# EAGLE design sensorboard-v2.0 (EAGLE 5.05)
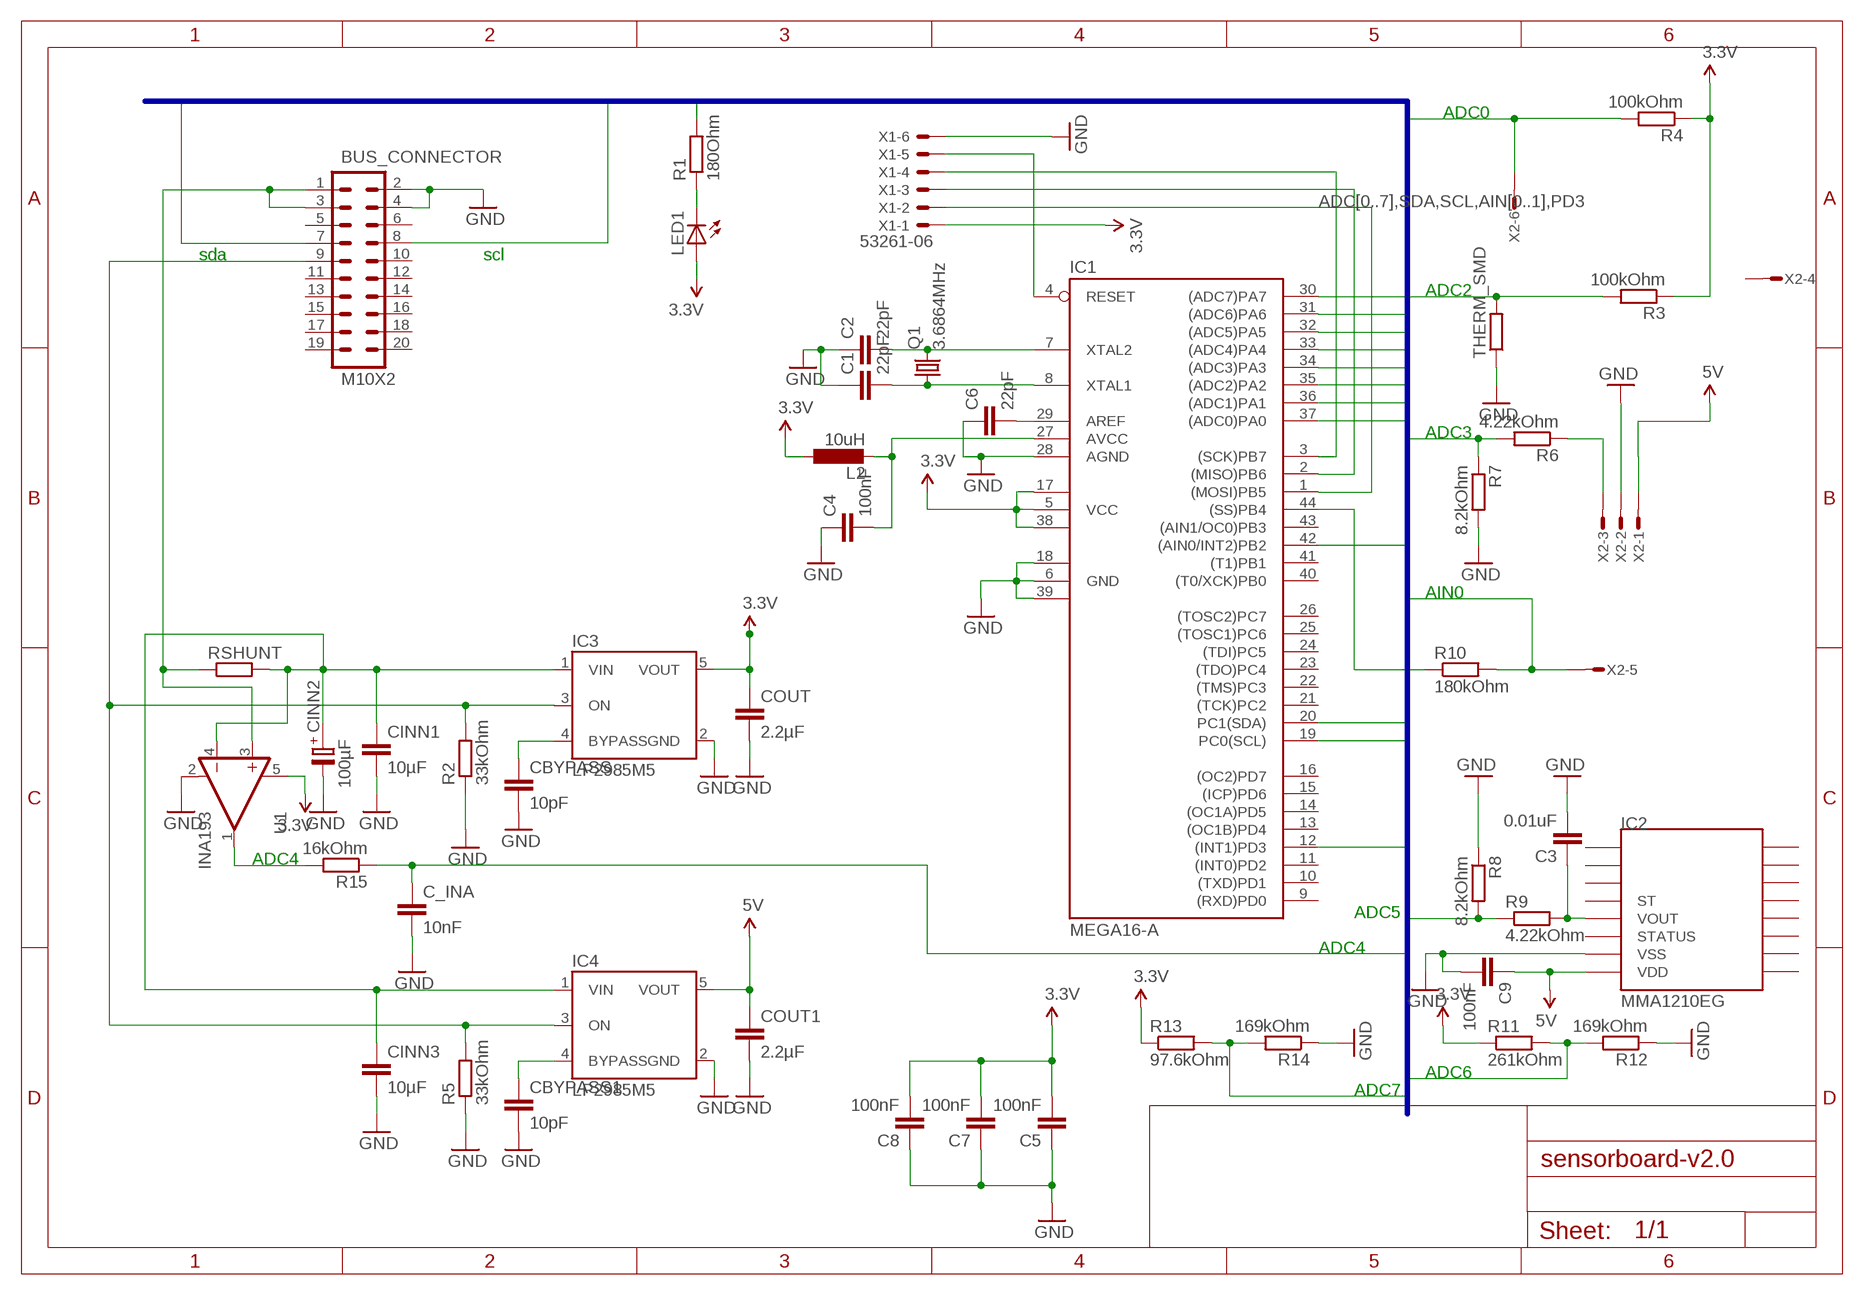
[diagram p0: schematic, sheet 1]

## Parts
BUS_CONNECTOR  M10X2  [2X10]
C1  22pF  C-EUC0805  [C0805]
C2  22pF  C-EUC0805  [C0805]
C3  0.01uF  C-EUC0805  [C0805]
C4  100nF  C-EUC0805  [C0805]
C5  100nF  C-EUC0805  [C0805]
C6  22pF  C-EUC0805  [C0805]
C7  100nF  C-EUC0805  [C0805]
C8  100nF  C-EUC0805  [C0805]
C9  100nF  C-EUC0805  [C0805]
C_INA  10nF  C-EUC0805  [C0805]
CBYPASS  10pF  C-EUC0805  [C0805]
CBYPASS1  10pF  C-EUC0805  [C0805]
CINN1  10µF  C-EUC0805  [C0805]
CINN2  100µF  C-PR-SMD-SV-C  [SV-C]
CINN3  10µF  C-EUC0805  [C0805]
COUT  2.2µF  C-EUC0805  [C0805]
COUT1  2.2µF  C-EUC0805  [C0805]
IC1  MEGA16-A  [TQFP44]
IC2  MMA1210EG  [SOIC-16]
IC3  LP2985M5  [SOT23-5]
IC4  LP2985M5  [SOT23-5]
L2  10uH  INDUCTOR  [C0805]
LED1  LEDCHIPLED_0805  [CHIPLED_0805]
Q1  3.6864MHz  CRYSTALHC49UP  [HC49UP]
R1  180Ohm  R-EU_R0805  [R0805]
R2  33kOhm  R-EU_R0805  [R0805]
R3  100kOhm  R-EU_R0805  [R0805]
R4  100kOhm  R-EU_R0805  [R0805]
R5  33kOhm  R-EU_R0805  [R0805]
R6  4.22kOhm  R-EU_R0805  [R0805]
R7  8.2kOhm  R-EU_R0805  [R0805]
R8  8.2kOhm  R-EU_R0805  [R0805]
R9  4.22kOhm  R-EU_R0805  [R0805]
R10  180kOhm  R-EU_R0805  [R0805]
R11  261kOhm  R-EU_R0805  [R0805]
R12  169kOhm  R-EU_R0805  [R0805]
R13  97.6kOhm  R-EU_R0805  [R0805]
R14  169kOhm  R-EU_R0805  [R0805]
R15  16kOhm  R-EU_R0805  [R0805]
RSHUNT  R-EU_R0805  [R0805]
THERM_SMD  R-EU_R0805  [R0805]
U1  INA193  [SOT23-5]
X1  53261-06  [53261-06]
X2  MICROMATCH-6SM  [MMT-SMD-6]

## Nets
3.3V: C5.2 C7.2 C8.2 COUT.1 IC1.5(VCC) IC1.17(VCC1) IC1.38(VCC2) IC3.5(VOUT) L2.1 LED1.A R3.1 R4.1 R11.1 R13.1 U1.5(V+) X1.1
5V: C9.1 COUT1.1 IC2.VDD IC4.5(VOUT) X2.1
ADC0: IC1.37((ADC0)PA0) R4.2 X2.6
ADC1: IC1.36((ADC1)PA1)
ADC2: IC1.35((ADC2)PA2) R3.2 THERM_SMD.2
ADC3: IC1.34((ADC3)PA3) R6.2 R7.1
ADC4: C_INA.1 IC1.33((ADC4)PA4) R15.1
ADC5: IC1.32((ADC5)PA5) R8.2 R9.1
ADC6: IC1.31((ADC6)PA6) R11.2 R12.2
ADC7: IC1.30((ADC7)PA7) R13.2 R14.2
AIN0: IC1.42((AIN0/INT2)PB2) R10.2 X2.5
GND: BUS_CONNECTOR.2 BUS_CONNECTOR.4 C1.1 C2.1 C3.2 C4.1 C5.1 C6.1 C7.1 C8.1 C9.2 C_INA.2 CBYPASS1.2 CBYPASS.2 CINN1.2 CINN2.- CINN3.2 COUT1.2 COUT.2 IC1.6(GND) IC1.18(GND1) IC1.28(AGND) IC1.39(GND2) IC2.VSS IC3.2(GND) IC4.2(GND) R2.1 R5.1 R7.2 R8.1 R12.1 R14.1 THERM_SMD.1 U1.2(GND) X1.6 X2.2
MISO: IC1.2((MISO)PB6) X1.3
MOSI: IC1.1((MOSI)PB5) X1.2
N$1: LED1.C R1.1
N$2: IC1.44((SS)PB4) R10.1
N$3: C6.2 IC1.29(AREF)
N$4: C1.2 IC1.8(XTAL1) Q1.1
N$5: C2.2 IC1.7(XTAL2) Q1.2
N$6: R6.1 X2.3
N$7: CBYPASS.1 IC3.4(BYPASS)
N$8: CINN1.1 CINN2.+ CINN3.1 IC3.1(VIN) IC4.1(VIN) RSHUNT.2 U1.4(VIN-)
N$9: C4.2 IC1.27(AVCC) L2.2
N$10: BUS_CONNECTOR.9 IC3.3(ON) IC4.3(ON) R2.2 R5.2
N$11: BUS_CONNECTOR.1 BUS_CONNECTOR.3 RSHUNT.1 U1.3(VIN+)
N$12: CBYPASS1.1 IC4.4(BYPASS)
N$13: C3.1 IC2.VOUT R9.2
N$14: R15.2 U1.1(OUT)
PD3: IC1.12((INT1)PD3) R1.2
RST: IC1.4(RESET) X1.5
SCK: IC1.3((SCK)PB7) X1.4
SCL: BUS_CONNECTOR.8 IC1.19(PC0(SCL))
SDA: BUS_CONNECTOR.7 IC1.20(PC1(SDA))
Unconnected: BUS_CONNECTOR.5 BUS_CONNECTOR.6 BUS_CONNECTOR.10 BUS_CONNECTOR.11 BUS_CONNECTOR.12 BUS_CONNECTOR.13 BUS_CONNECTOR.14 BUS_CONNECTOR.15 BUS_CONNECTOR.16 BUS_CONNECTOR.17 BUS_CONNECTOR.18 BUS_CONNECTOR.19 BUS_CONNECTOR.20 IC1.9((RXD)PD0) IC1.10((TXD)PD1) IC1.11((INT0)PD2) IC1.13((OC1B)PD4) IC1.14((OC1A)PD5) IC1.15((ICP)PD6) IC1.16((OC2)PD7) IC1.21((TCK)PC2) IC1.22((TMS)PC3) IC1.23((TDO)PC4) IC1.24((TDI)PC5) IC1.25((TOSC1)PC6) IC1.26((TOSC2)PC7) IC1.40((T0/XCK)PB0) IC1.41((T1)PB1) IC1.43((AIN1/OC0)PB3) IC2.P$1 IC2.P$2 IC2.P$3 IC2.P$4 IC2.P$5 IC2.P$6 IC2.P$7 IC2.P$8 IC2.P$9 IC2.P$10 IC2.P$11 IC2.ST IC2.STATUS X2.4

## Buses
ADC[0..7],SDA,SCL,AIN[0..1],PD3

## Notes on the sheet
- ADC0
- sda | scl
- ADC2
- ADC3
- AIN0
- ADC4
- ADC5
- ADC4
- ADC6
- ADC7

## Library data of the parts
BUS_CONNECTOR = SparkFunedit:M10X2: This was SPECIALLY designed to be used with our Graphic LCD Backpack. Be sure you want to use this! It is not only staggered on each line of header holes, but IT IS ALSO offset of the center point of the top and bottom lines by 5 mil. This causes the headers to lock into place on the "standard" footprint on the LCD screen. The extra squares on the tdocu layer are there simply to reference other pins (if you were to actually populate a longer header than ten long - this is what we do with the backpacks).
C1-C9 = resistor:C-EU: CAPACITOR, European symbol
C_INA CBYPASS CBYPASS1 CINN1 CINN3 COUT COUT1 = rcl:C-EU: CAPACITOR, European symbol
CINN2 = cap-pan40:C-PR: POLARIZED ELECTROLYTIC/TANTALUM
IC1 = avr-5:MEGA16: MICROCONTROLLER 16 Kbytes FLASH 1 kbytes SRAM 512 bytes EEPROM USART 8-channel 10 bit ADC
IC2 = cansat:MMA1210EG
IC3 IC4 = v-reg-3:LP2985: National Semiconductor <http://www.national.com> Micropower Linear Regulator 150mA regulated output, Vin 16V max., ultra-low dropout of 300mV @ 150mA, 1µA standby current, low noise
L2 = cansat:INDUCTOR
LED1 = led:LED: LED OSRAM: - CHIPLED LG R971, LG N971, LY N971, LG Q971, LY Q971, LO R971, LY R971 LH N974, LH R974 LS Q976, LO Q976, LY Q976 LO Q996 - Hyper CHIPLED LW Q18S LB Q993, LB Q99A, LB R99A - SideLED LS A670, LO A670, LY A670, LG A670, LP A670 LB A673, LV A673, LT A673, LW A673 LH A674 LY A675 LS A676, LA A676, LO A676, LY A676, LW A676 LS A679, LY A679, LG A679 - Hyper Micro SIDELED® LS Y876, LA Y876, LO Y876, LY Y876 LT Y87S - SmartLED LW L88C, LW L88S LB L89C, LB L89S, LG L890 LS L89K, LO L89K, LY L89K LS L896, LA L896, LO L896, LY L896 - TOPLED LS T670, LO T670, LY T670, LG T670, LP T670 LSG T670, LSP T670, LSY T670, LOP T670, LYG T670 LG T671, LOG T671, LSG T671 LB T673, LV T673, LT T673, LW T673 LH T674 LS T676, LA T676, LO T676, LY T676, LB T676, LH T676, LSB T676, LW T676 LB T67C, LV T67C, LT T67C, LS T67K, LO T67K, LY T67K, LW E67C LS E67B, LA E67B, LO E67B, LY E67B, LB E67C, LV E67C, LT E67C LW T67C LS T679, LY T679, LG T679 LS T770, LO T770, LY T770, LG T770, LP T770 LB T773, LV T773, LT T773, LW T773 LH T774 LS E675, LA E675, LY E675, LS T675 LS T776, LA T776, LO T776, LY T776, LB T776 LHGB T686 LT T68C, LB T68C - Hyper Mini TOPLED® LB M676 - Mini TOPLED Santana® LG M470 LS M47K, LO M47K, LY M47K Source: http://www.osram.convergy.de LUXEON: - LUMILED® LXK2-PW12-R00, LXK2-PW12-S00, LXK2-PW14-U00, LXK2-PW14-V00 LXK2-PM12-R00, LXK2-PM12-S00, LXK2-PM14-U00 LXK2-PE12-Q00, LXK2-PE12-R00, LXK2-PE12-S00, LXK2-PE14-T00, LXK2-PE14-U00 LXK2-PB12-K00, LXK2-PB12-L00, LXK2-PB12-M00, LXK2-PB14-N00, LXK2-PB14-P00, LXK2-PB14-Q00 LXK2-PR12-L00, LXK2-PR12-M00, LXK2-PR14-Q00, LXK2-PR14-R00 LXK2-PD12-Q00, LXK2-PD12-R00, LXK2-PD12-S00 LXK2-PH12-R00, LXK2-PH12-S00 LXK2-PL12-P00, LXK2-PL12-Q00, LXK2-PL12-R00 Source: www.luxeon.com KINGBRIGHT: KA-3528ASYC Source: www.kingbright.com
Q1 = crystal:CRYSTAL: CRYSTAL
R1 R3 R4 R6-R14 THERM_SMD = resistor:R-EU_: RESISTOR, European symbol
R2 R5 R15 RSHUNT = rcl:R-EU_: RESISTOR, European symbol
U1 = burr-brown:INA193
X1 = con-molex:53?-06: CONNECTOR wire to board 1.25 mm (.049 inch) pitch header
X2 = con-amp-micromatch:MICROMATCH-6: MicroMaTch 6 7-215464-6 / 0-215464-6 Drawing Number C-215464 DDEController.pdf

## Board
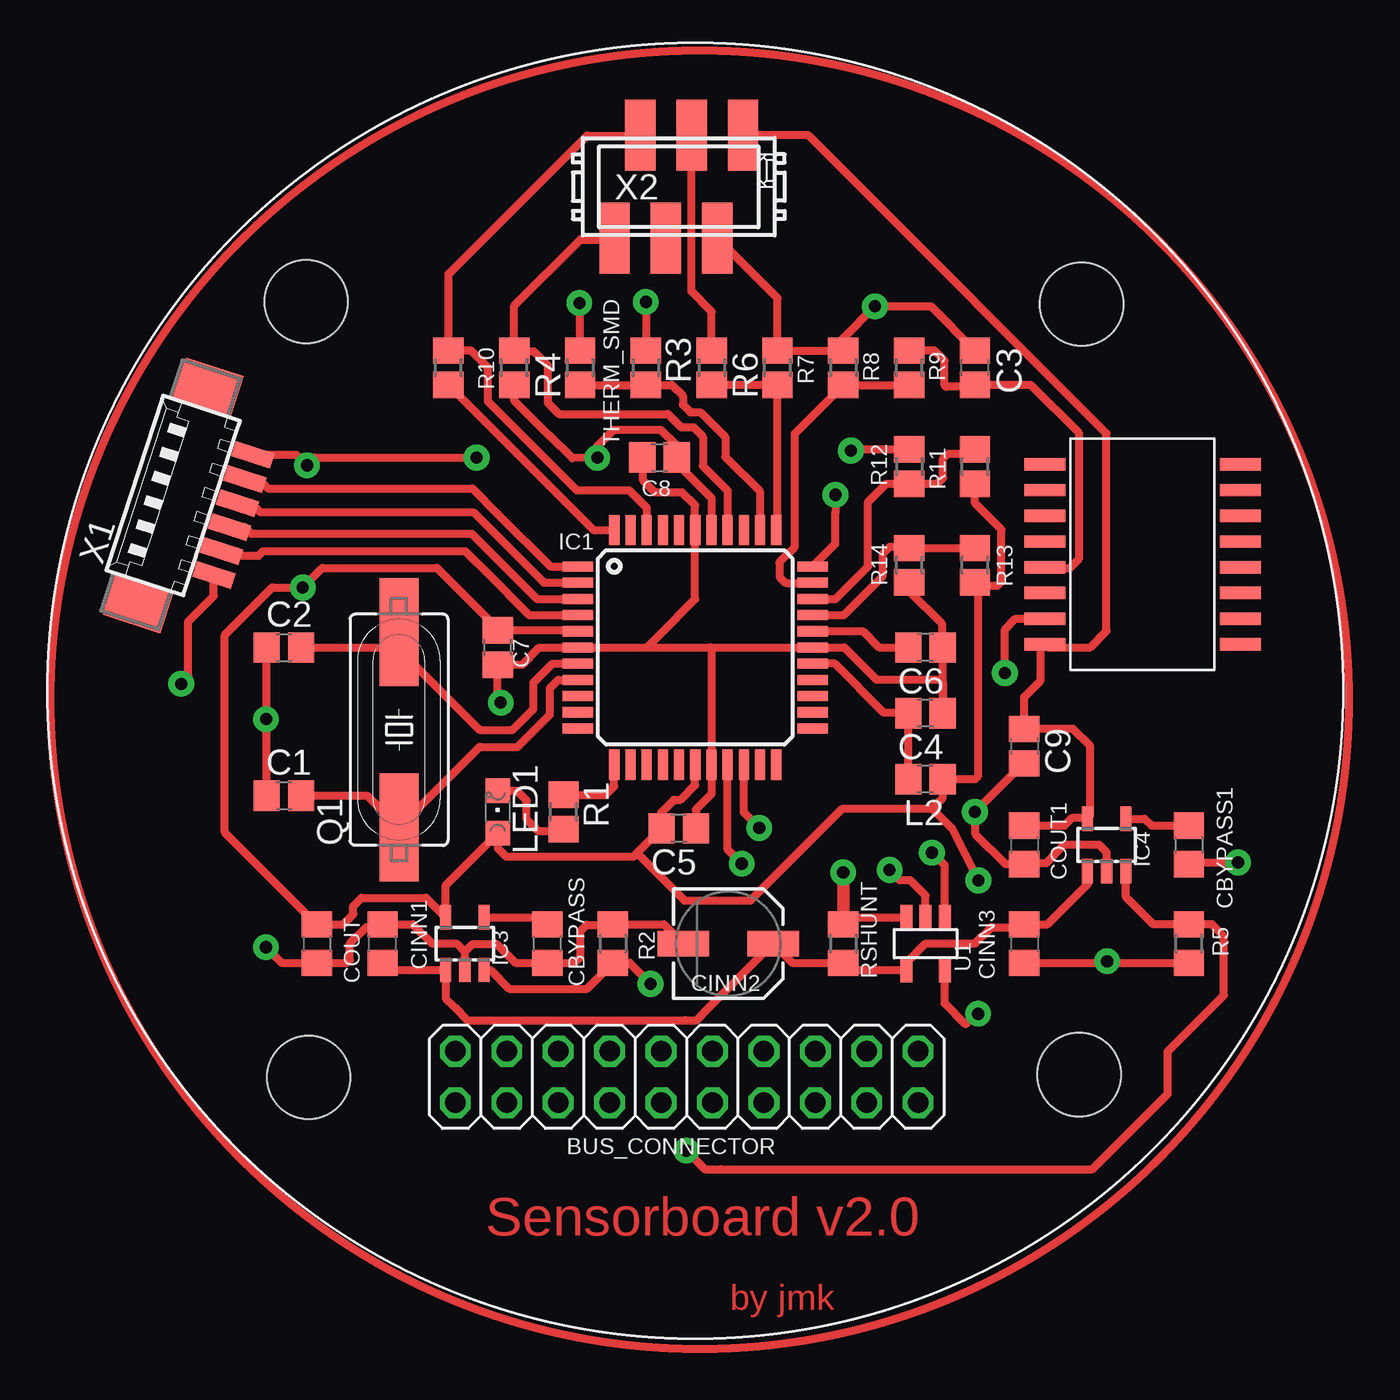
[diagram p1: board, top side]
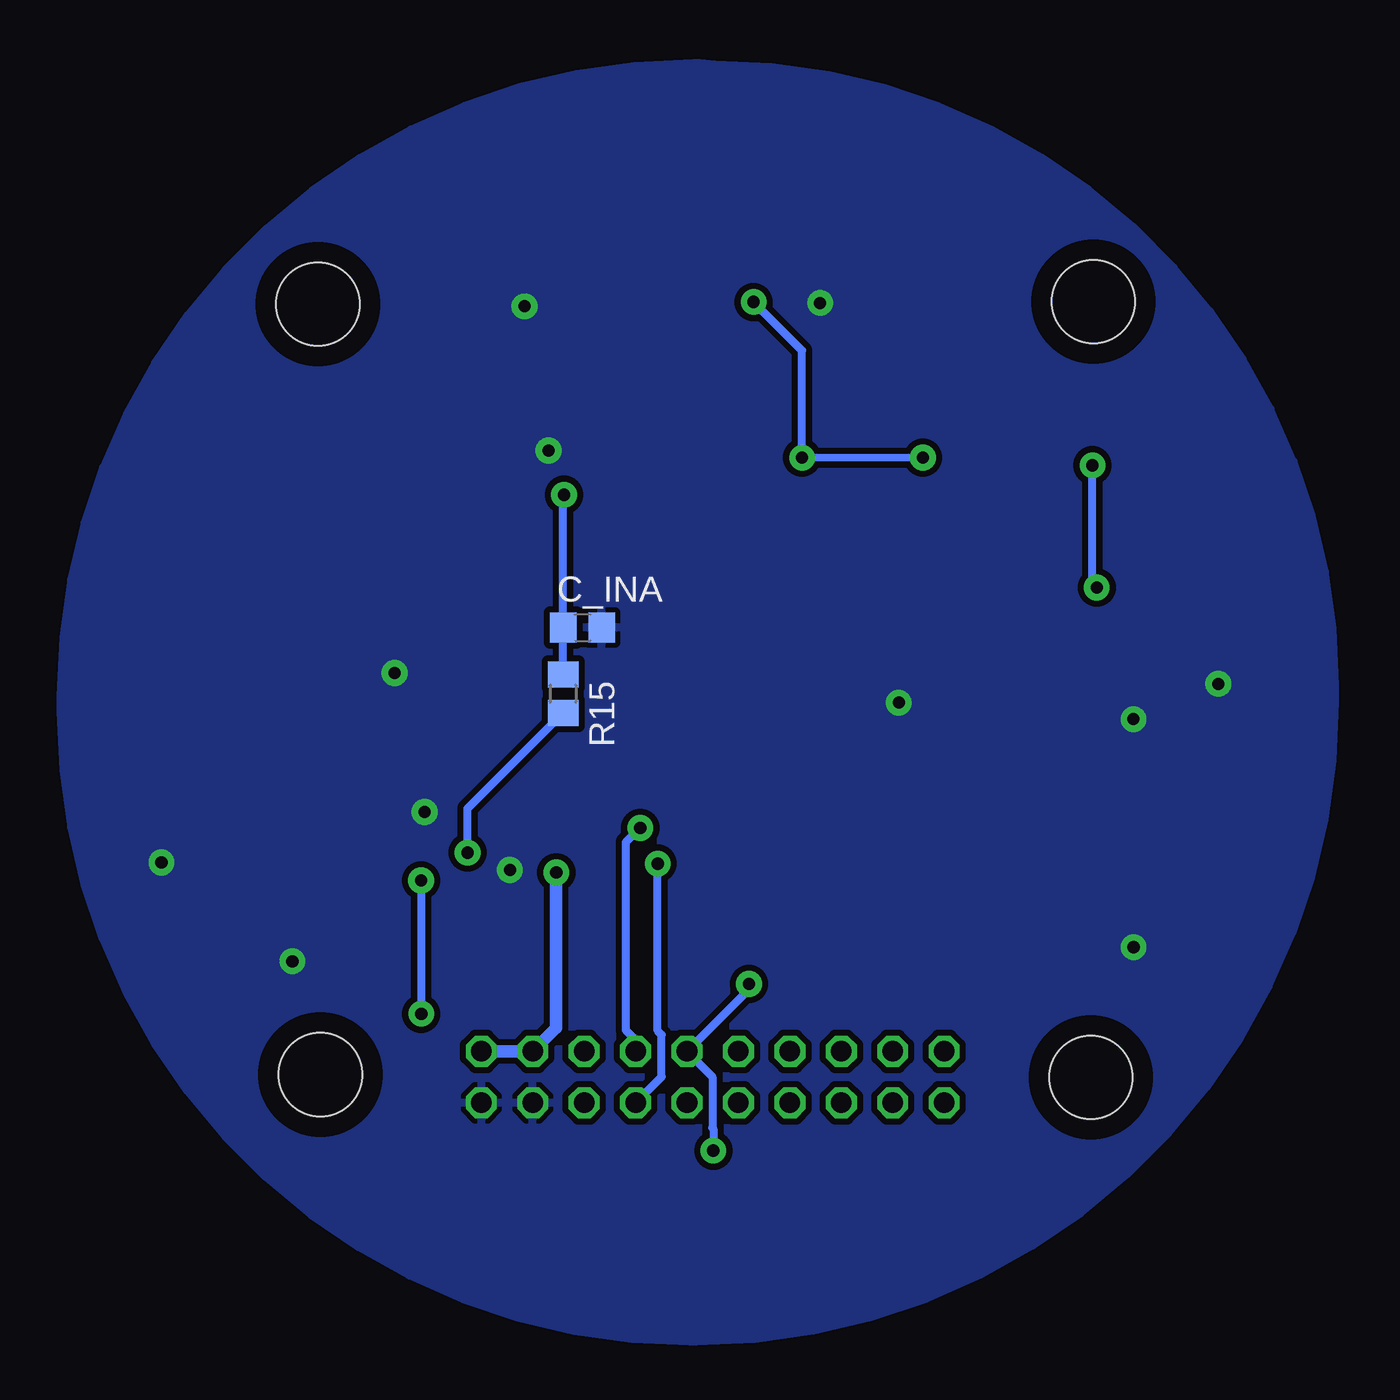
[diagram p2: board, bottom side, seen from below]

No outline drawn. Coordinates in mm, seen from the top.
Copper layers (1*16): Top 0.035mm / dielectric 1.5mm / Bottom 0.035mm
Design rules "default *": minimum track width 10mil, minimum drill 0.0152mm, track to track 12mil, track to pad 12mil, pad to pad 12mil, via to via 12mil, smd to smd 11mil, copper to edge 40mil, drill to drill 8mil, minimum pad ring 10mil, minimum via ring 8mil, stop-mask expansion 4mil, vias tented up to drill 0mil, thermal gap 10mil

### Footprints (pad centres in the part's own frame; a part is rotated, then mirrored left to right if it is on the bottom)
2X10 = drill 1.016 octagon: 1 -11.013,-7.687; 2 -11.013,-5.147; 3 -8.473,-7.687; 4 -8.473,-5.147; 5 -5.933,-7.687; 6 -5.933,-5.147; 7 -3.393,-7.687; 8 -3.393,-5.147; 9 -0.853,-7.687; 10 -0.853,-5.147; 11 1.687,-7.687; 12 1.687,-5.147; 13 4.227,-7.687; 14 4.227,-5.147; 15 6.767,-7.687; 16 6.767,-5.147; 17 9.307,-7.687; 18 9.307,-5.147; 19 11.847,-7.687; 20 11.847,-5.147 | hole 4.1: 19.093,-6.407; 19.22,-44.715; -19.087,-44.591; -18.964,-6.533
C0805 = smd 1.3 x 1.5: 1 -0.85,0; 2 0.85,0
C0805' = smd 1.3 x 1.5: 1 -0.95,0; 2 0.95,0
SV-C = smd 2.54 x 1.27: + -2.223,0; - 2.223,0
TQFP44 = smd 1.5 x 0.5: 1 -5.8,4; 2 -5.8,3.2; 3 -5.8,2.4; 4 -5.8,1.6; 5 -5.8,0.8; 6 -5.8,0; 7 -5.8,-0.8; 8 -5.8,-1.6; 9 -5.8,-2.4; 10 -5.8,-3.2; 11 -5.8,-4; 23 5.8,-4; 24 5.8,-3.2; 25 5.8,-2.4; 26 5.8,-1.6; 27 5.8,-0.8; 28 5.8,0; 29 5.8,0.8; 30 5.8,1.6; 31 5.8,2.4; 32 5.8,3.2; 33 5.8,4 | smd 0.5 x 1.5: 12 -4,-5.8; 13 -3.2,-5.8; 14 -2.4,-5.8; 15 -1.6,-5.8; 16 -0.8,-5.8; 17 0,-5.8; 18 0.8,-5.8; 19 1.6,-5.8; 20 2.4,-5.8; 21 3.2,-5.8; 22 4,-5.8; 34 4,5.8; 35 3.2,5.8; 36 2.4,5.8; 37 1.6,5.8; 38 0.8,5.8; 39 0,5.8; 40 -0.8,5.8; 41 -1.6,5.8; 42 -2.4,5.8; 43 -3.2,5.8; 44 -4,5.8
SOIC-16 = smd 0.61 x 2.03: P$1 -2.54,2.54; P$2 -1.27,2.54; P$3 0,2.54; P$4 1.27,2.54; P$5 2.54,2.54; P$6 3.81,2.54; P$7 5.08,2.54; P$8 6.35,2.54; P$9 -2.54,-7.11; P$10 -1.27,-7.11; P$11 0,-7.11; ST 1.27,-7.11; STATUS 3.81,-7.11; VDD 6.35,-7.11; VOUT 2.54,-7.11; VSS 5.08,-7.11
SOT23-5 = smd 0.55 x 1.2: 1 -0.95,-1.3; 2 0,-1.3; 3 0.95,-1.3; 4 0.95,1.3; 5 -0.95,1.3
CHIPLED_0805 = smd 1.2 x 1.2: A 0,-1.05; C 0,1.05
HC49UP = smd 5.334 x 1.93: 1 -4.826,0; 2 4.826,0
R0805 = smd 1.3 x 1.5: 1 -0.85,0; 2 0.85,0
R0805' = smd 1.3 x 1.5: 1 -0.95,0; 2 0.95,0
SOT23-5' = smd 0.6 x 1.2: 1 -0.95,-1.306; 2 0,-1.306; 3 0.95,-1.306; 4 0.95,1.306; 5 -0.95,1.306
53261-06 = smd 0.8 x 2: 1 3.125,-2.5; 2 1.875,-2.5; 3 0.625,-2.5; 4 -0.625,-2.5; 5 -1.875,-2.5; 6 -3.125,-2.5 | smd 2.1 x 3: S1 5.625,0.625; S2 -5.625,0.625
MMT-SMD-6 = smd 1.5 x 3.5: 1 3.175,2.54; 2 1.905,-2.54; 3 0.635,2.54; 4 -0.635,-2.54; 5 -1.905,2.54; 6 -3.175,-2.54

### Placement (x,y rotation side)
BUS_CONNECTOR  47.96,13 180 top
C1  27.64,33.32 0 top
C2  27.64,40.64 0 top
C3  61.77,54.46 90 top
C4  59.33,37.39 180 top
C5  47.14,31.7 180 top
C6  59.33,40.64 180 top
C7  38.2,40.64 90 top
C8  46.19,50.02 0 top
C9  64.21,35.76 270 top
C_INA  10nF  [C0805']  53.97,41.62 0 bottom
CBYPASS  10pF  [C0805']  40.64,26.01 270 top
CBYPASS1  10pF  [C0805']  72.34,30.89 270 top
CINN1  10µF  [C0805']  32.51,26.01 90 top
CINN2  49.58,26.01 180 top
CINN3  10µF  [C0805']  64.21,26.01 270 top
COUT  2.2µF  [C0805']  29.26,26.01 270 top
COUT1  2.2µF  [C0805']  64.21,30.89 270 top
IC1  47.96,40.64 0 top
IC2  72.34,47.14 270 top
IC3  36.58,26.01 0 top
IC4  68.28,30.89 0 top
L2  59.33,34.14 180 top
LED1  38.2,32.51 0 top
Q1  33.32,36.58 90 top
R1  41.45,32.51 90 top
R2  33kOhm  [R0805']  43.89,26.01 270 top
R3  45.52,54.46 270 top
R4  39.01,54.46 90 top
R5  33kOhm  [R0805']  72.34,26.01 90 top
R6  48.77,54.46 270 top
R7  52.02,54.46 90 top
R8  55.27,54.46 270 top
R9  58.52,54.46 90 top
R10  35.76,54.46 90 top
R11  61.77,49.58 90 top
R12  58.52,49.58 270 top
R13  61.77,44.7 90 top
R14  58.52,44.7 90 top
R15  16kOhm  [R0805']  54.93,38.35 270 bottom
RSHUNT  [R0805']  55.27,26.01 270 top
THERM_SMD  42.27,54.46 270 top
U1  INA193  [SOT23-5']  59.33,26.01 180 top
X1  22.76,47.96 72 top
X2  47.14,63.4 0 top

### Tracks (layer width: path | path; a pad name or v marks a point on that pad's centre or on a via)
3.3V  (via drill 0.6 pad 1.27)
  Top 0.406: 42.1,41.49 IC1.5 42.1,41.49 | X1.1 28.26,50.16 v28.78,49.64 29.16,50.02 v37.15,50.02 | C7.2 38.03,41.49 | C7.2 42.1,41.49 | R11.1 61.77,47.77 63.08,46.46 63.08,43.9 62.87,43.69 61.94,43.69 | 61.94,43.69 R13.1 | IC1.17 47.95,33.85 47.22,33.11 46.9,33.11 46.28,32.49 46.29,32.48 C5.2 45.08,30.48 | R4.1 39.01,52.84 40.76,51.09 40.79,51.09 41.89,49.99 v43.12,50.01 43.12,50.59 43.93,51.4 46.25,51.4 47.02,50.63 47.02,50.05 C8.2 47.04,49.74 48.23,48.55 48.76,48.02 IC1.38 | 45.08,30.48 44.91,30.32 38.62,30.32 38.2,30.73 LED1.A 35.63,28.89 IC3.5 34.66,28.27 31.47,28.27 31.06,27.85 31.06,27.46 30.55,26.96 COUT.1 24.71,31.51 24.71,41.24 27.07,43.6 v28.57,43.6 29.47,44.51 29.54,44.57 35.2,44.57 38.2,41.58 C7.2 | 45.08,30.48 47.42,28.14 50.7,28.14 50.7,28.16 53.84,31.3 55.23,32.69 59.66,32.69 | U1.5 60.28,23.05 61.31,22.03 61.83,22.55 v61.93,22.55 | v45.52,57.71 R3.1 | 61.94,43.69 61.94,34.3 61.77,34.14 L2.1 60.18,33.22 59.66,32.69 | v61.95,29.13 60.64,31.7 59.66,32.69
  Bottom 0.406: v28.78,49.64 28.78,43.81 v28.57,43.6 | v37.15,50.02 37.18,49.99 v43.12,50.01 43.12,55.32 v45.52,57.71 | v61.95,29.13 61.95,22.56 v61.93,22.55
5V
  Top 0.406: X2.1 53.54,65.94 55.27,64.21 68.28,51.21 68.28,41.45 67.46,40.64 65.38,40.64 IC2.VDD 65.02,40.59 65.02,39.01 64.21,38.2 C9.1 66.61,36.61 67.46,35.76 67.46,32.32 IC4.5 67.28,32.23 66.59,32.23 66.2,31.84 COUT1.1
ADC0
  Top 0.406: IC1.37 49.55,48.39 48.33,49.61 48.33,51.06 47.87,51.52 47.27,51.52 46.61,52.17 41.23,52.17 40.67,52.73 40.67,54.58 39.98,55.27 39.05,55.27 R4.2 39.01,57.52 42.28,60.79 43.9,60.79 X2.6
ADC2
  Top 0.406: THERM_SMD.2 R3.2 46.8,53.61 47.34,53.07 47.34,52.64 47.72,52.26 48.21,52.26 49.45,51.02 49.45,50.06 51.14,48.36 51.14,46.45 IC1.35
ADC3
  Top 0.406: IC1.34 52.02,46.5 R7.1 R6.2
ADC4  (via drill 0.6 pad 1.27)
  Top 0.406: IC1.33 54.86,45.75 54.86,47.27 54.88,47.29 v54.88,48.18
  Bottom 0.406: R15.1 C_INA.1 54.92,48.14 v54.88,48.18
ADC5
  Top 0.406: IC1.32 53.75,43.83 52.41,43.83 52.12,44.13 52.12,44.79 52.12,44.85 52.88,45.61 52.88,51.21 R8.2 R9.1
ADC6
  Top 0.406: IC1.31 53.77,43.02 54.87,43.02 56.49,44.64 56.49,47.83 57.39,48.73 R12.2 59.92,48.73 60.2,49.01 60.2,49.97 60.44,50.21 61.55,50.21 R11.2
ADC7
  Top 0.406: IC1.30 55.02,42.24 55.3,42.24 55.55,42.49 57.23,44.17 57.23,44.45 57.23,45.28 57.57,45.62 58.45,45.62 R14.2 R13.2
AIN0
  Top 0.406: IC1.42 45.55,47.54 44.7,48.4 42.1,48.4 37.71,52.79 37.71,54.47 36.89,55.3 35.77,55.3 R10.2 35.76,59.09 42.6,65.93 X2.5
GND  (via drill 0.6 pad 1.27)
  Top 0.406: 47.95,46.45 IC1.39 | X2.2 52.02,57.89 R7.2 R8.1 55.27,55.93 v56.83,57.49 59.59,57.49 C3.2 | THERM_SMD.1 42.27,57.62 v42.23,57.66 | v38.34,37.91 38.2,38.06 C7.1 39.41,39.79 40.25,40.63 42.14,40.63 IC1.6 45.56,40.64 45.62,40.69 | 47.95,46.45 47.95,43.02 46.16,41.23 45.62,40.69 | 48.71,40.64 45.66,40.64 45.62,40.69 | 48.71,40.64 IC1.28 55.33,40.64 56.91,39.05 60.09,39.05 60.18,38.96 C4.1 C6.1 60.16,40.67 60.16,41.79 58.52,43.43 R14.1 | 48.71,40.64 48.76,40.59 IC1.18 48.76,33.4 47.99,32.64 C5.1 | 47.95,46.45 47.95,47.66 47.31,48.3 45.97,48.3 45.38,48.89 45.38,49.99 C8.1 | R12.1 55.72,50.43 v55.65,50.36 | v26.75,25.84 27.52,25.06 COUT.2 30.75,25.06 30.89,25.2 30.89,26.01 31.7,26.82 32.38,26.82 CINN1.2 34,26.96 34.95,26.01 35.76,26.01 36.16,26.01 36.57,25.6 | 36.57,25.6 IC3.2 | 36.57,25.6 36.96,25.99 38.15,25.99 39.08,25.06 CBYPASS.2 42,25.06 42.28,25.34 42.28,26.64 42.58,26.94 43.87,26.94 R2.1 46.41,26.96 CINN2.- | C2.1 26.79,37.13 v26.75,37.1 26.79,37.07 C1.1 | IC2.VSS 63.78,42.06 63.26,41.54 v63.26,39.38 | C9.2 64.17,34.91 v61.77,32.51 61.81,32.48 61.81,31.41 63.28,29.94 COUT1.2 64.27,29.99 65.3,29.99 66.2,30.9 67.9,30.9 68.28,30.53 IC4.2 | v74.77,30.02 72.42,30.02 CBYPASS1.2 | CINN3.2 68.22,25.06 v68.3,25.14 68.38,25.06 R5.1 | U1.2 59.33,28.38 58.58,29.14 58.07,29.14 v57.56,29.65 | X1.6 24.17,43.19 22.91,41.93 22.91,39.19 v22.57,38.84
  pour Bottom: 48.16,69.5 48.51,69.5 arc-90 79.76,38.24 79.76,37.47 arc-90 48.66,6.36 48.38,6.36 arc-90 16.77,37.96 16.77,38.74 arc-90 47.46,69.43
MISO
  Top 0.406: X1.3 26.02,47.78 26.47,47.33 37,47.33 39.02,45.3 40.49,43.84 IC1.2
MOSI
  Top 0.406: IC1.1 40.8,44.64 38.23,47.22 36.95,48.49 26.85,48.49 26.38,48.97 X1.2
N$1
  Top 0.406: LED1.C 39.15,33.56 39.62,33.08 39.62,32.15 40.19,31.59 41.38,31.59 R1.1
N$2
  Top 0.406: IC1.44 42.93,46.44 R10.1
N$3
  Top 0.406: IC1.29 56.23,41.44 57.03,40.64 C6.2
N$4
  Top 0.406: IC1.8 41.19,39.04 40.78,38.63 40.78,37.33 39.18,35.73 37.31,35.73 Q1.1 31.75,33.33 C1.2
N$5
  Top 0.406: IC1.7 40.91,39.84 39.97,38.9 39.97,37.6 38.94,36.57 37.29,36.57 33.05,40.81 33.05,41.12 Q1.2 32.56,40.64 C2.2
N$6
  Top 0.406: R6.1 48.77,57.23 47.77,58.23 47.77,65.93 X2.3
N$7
  Top 0.406: IC3.4 40.29,27.31 CBYPASS.1
N$8
  Top 0.406: CINN1.1 32.86,24.71 IC3.1 35.63,23.31 36.06,22.87 36.71,22.23 47.45,22.23 48.02,22.23 48.67,22.87 CINN2.+ 52.75,25.06 RSHUNT.2 55.63,24.7 U1.4 58.38,25.06 59.33,26.01 61.77,26.01 62.59,26.82 64.07,26.82 CINN3.1 65.35,26.96 67.36,28.97 67.36,29.55 IC4.1
N$9
  Top 0.406: IC1.27 54.85,39.84 57.28,37.41 58.47,37.41 C4.2 L2.2
N$10  (via drill 0.6 pad 1.27)
  Top 0.406: IC3.3 37.84,24.71 38.77,23.78 42.61,23.78 R2.2 | IC4.3 69.23,28.32 70.58,26.96 R5.2 73.48,26.96 74.08,26.36 74.08,23.46 71.3,20.68 71.3,18.58 67.58,14.87 49.21,14.87 48.43,14.87 v47.51,15.79 | R2.2 43.89,24.94 | v45.75,24.02 44.71,25.06 R2.2
  Bottom 0.406: v47.51,15.79 47.51,16.87 47.55,16.92 47.55,19.44 BUS_CONNECTOR.9 45.75,23.75 v45.75,24.02
N$11  (via drill 0.6 pad 1.27)
  Top 0.406: U1.3 55.63,27.32 RSHUNT.1
  Top 0.61: v55.27,29.53 RSHUNT.1
  Bottom 0.61: v55.27,29.53 55.27,21.85 BUS_CONNECTOR.3 BUS_CONNECTOR.1
N$12
  Top 0.406: CBYPASS1.1 70.5,31.84 70.17,32.17 69.24,32.17 IC4.4
N$13
  Top 0.406: R9.2 59.77,55.31 60.27,54.8 60.27,53.6 60.34,53.52 61.69,53.52 C3.1 64.53,53.61 66.92,51.22 66.92,45.03 66.46,44.57 65.26,44.57 IC2.VOUT
N$14  (via drill 0.6 pad 1.27)
  Top 0.406: U1.1 60.28,29.87 v59.65,30.5
  Bottom 0.406: v59.65,30.5 59.65,32.68 R15.2
PD3
  Top 0.406: IC1.12 43.95,33.78 43.53,33.35 41.46,33.35 R1.2
RST
  Top 0.406: X1.5 25.32,45.4 25.55,45.18 26.39,45.18 26.61,45.4 36.6,45.4 36.81,45.18 37.61,44.38 39.75,42.24 IC1.4
SCK
  Top 0.406: X1.4 25.69,46.59 26.02,46.26 36.92,46.26 38.76,44.42 40.14,43.04 IC1.3
SCL  (via drill 0.6 pad 1.27)
  Top 0.406: IC1.19 49.55,30.66 v50.26,29.96
  Bottom 0.406: v50.26,29.96 50.26,21.7 50.06,21.51 50.06,19.43 BUS_CONNECTOR.8
SDA  (via drill 0.6 pad 1.27)
  Top 0.406: v51.12,31.73 50.35,32.49 IC1.20
  Bottom 0.406: v51.12,31.73 51.35,31.5 51.83,31.02 51.83,21.73 51.35,21.25 BUS_CONNECTOR.7
(copper drawn outside any net)
  shapes: Top circle x1

### Text on the board
Top: Sensorboard v2.0 | by jmk